# EAGLE design SVRBase (EAGLE 9.6.2)
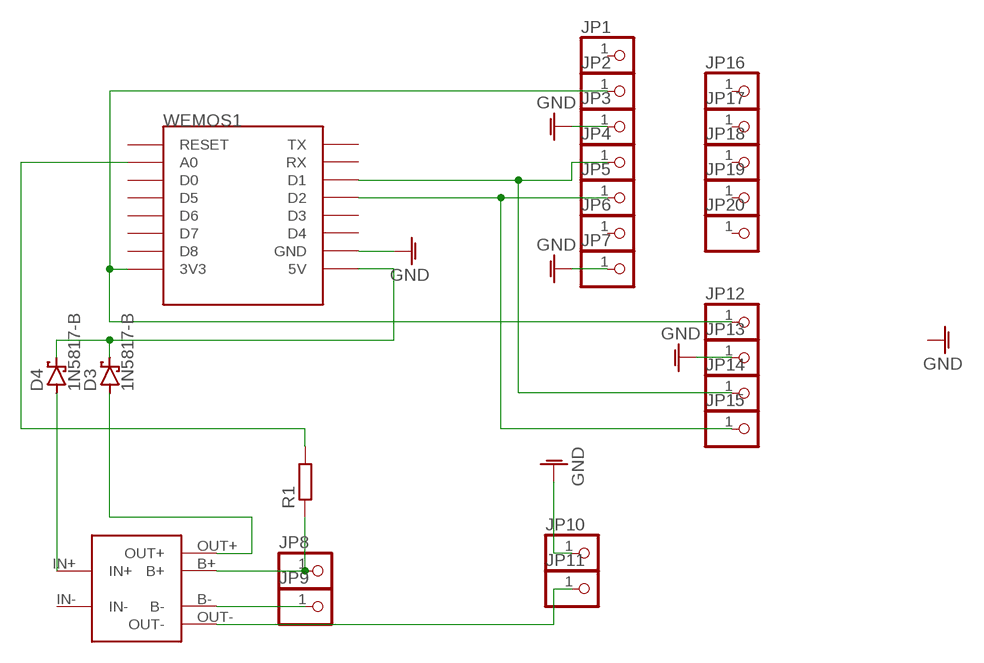
[diagram p0: schematic, sheet 1]

## Parts
CHARGING  TP4056-PTH  [TP4056-PTH]
D3  1N5817-B  [DO41-7.6]
D4  1N5817-B  [DO41-7.6]
JP1  PINHD-1X1  [1X01]
JP2  PINHD-1X1  [1X01]
JP3  PINHD-1X1  [1X01]
JP4  PINHD-1X1  [1X01]
JP5  PINHD-1X1  [1X01]
JP6  PINHD-1X1  [1X01]
JP7  PINHD-1X1  [1X01]
JP8  PINHD-1X1  [1X01]
JP9  PINHD-1X1  [1X01]
JP10  PINHD-1X1  [1X01]
JP11  PINHD-1X1  [1X01]
JP12  PINHD-1X1  [1X01]
JP13  PINHD-1X1  [1X01]
JP14  PINHD-1X1  [1X01]
JP15  PINHD-1X1  [1X01]
JP16  PINHD-1X1  [1X01]
JP17  PINHD-1X1  [1X01]
JP18  PINHD-1X1  [1X01]
JP19  PINHD-1X1  [1X01]
JP20  PINHD-1X1  [1X01]
R1  R-EU_0204/7  [0204/7]
WEMOS1  WEMOS-D1-MINI  [WEMOS-D1-MINI]

## Nets
GNDA: JP3.1 JP7.1 JP10.1 JP13.1 WEMOS1.GND ; supply symbol labelled GND
N$1: JP4.1 JP14.1 WEMOS1.D1
N$2: JP2.1 JP12.1 WEMOS1.3V3
N$3: CHARGING.B+ JP8.1 R1.1
N$4: D3.C D4.C WEMOS1.5V
N$5: CHARGING.IN+ D4.A
N$6: CHARGING.OUT+ D3.A
N$7: CHARGING.B- JP9.1
N$8: R1.2 WEMOS1.A0
N$9: CHARGING.OUT- JP11.1
N$10: JP5.1 JP15.1 WEMOS1.D2
Unconnected: CHARGING.IN- JP1.1 JP6.1 JP16.1 JP17.1 JP18.1 JP19.1 JP20.1 WEMOS1.D0 WEMOS1.D3 WEMOS1.D4 WEMOS1.D5 WEMOS1.D6 WEMOS1.D7 WEMOS1.D8 WEMOS1.RESET WEMOS1.RX WEMOS1.TX

## Library data of the parts
CHARGING = 32teeth - TP4056 Module:TP4056-PTH
D3 D4 = diode:1N581*: 1.0A SCHOTTKY BARRIER RECTIFIER Source: http://www.diodes.com/datasheets/ds23001.pdf
JP1-JP20 = pinhead:PINHD-1X1: PIN HEADER
R1 = rcl:R-EU_: RESISTOR, European symbol; SPICEPREFIX: R
WEMOS1 = Eagle Mixed Library:WEMOS-D1-MINI: WeMos.cc D1 mini ESP8266 module

## Board
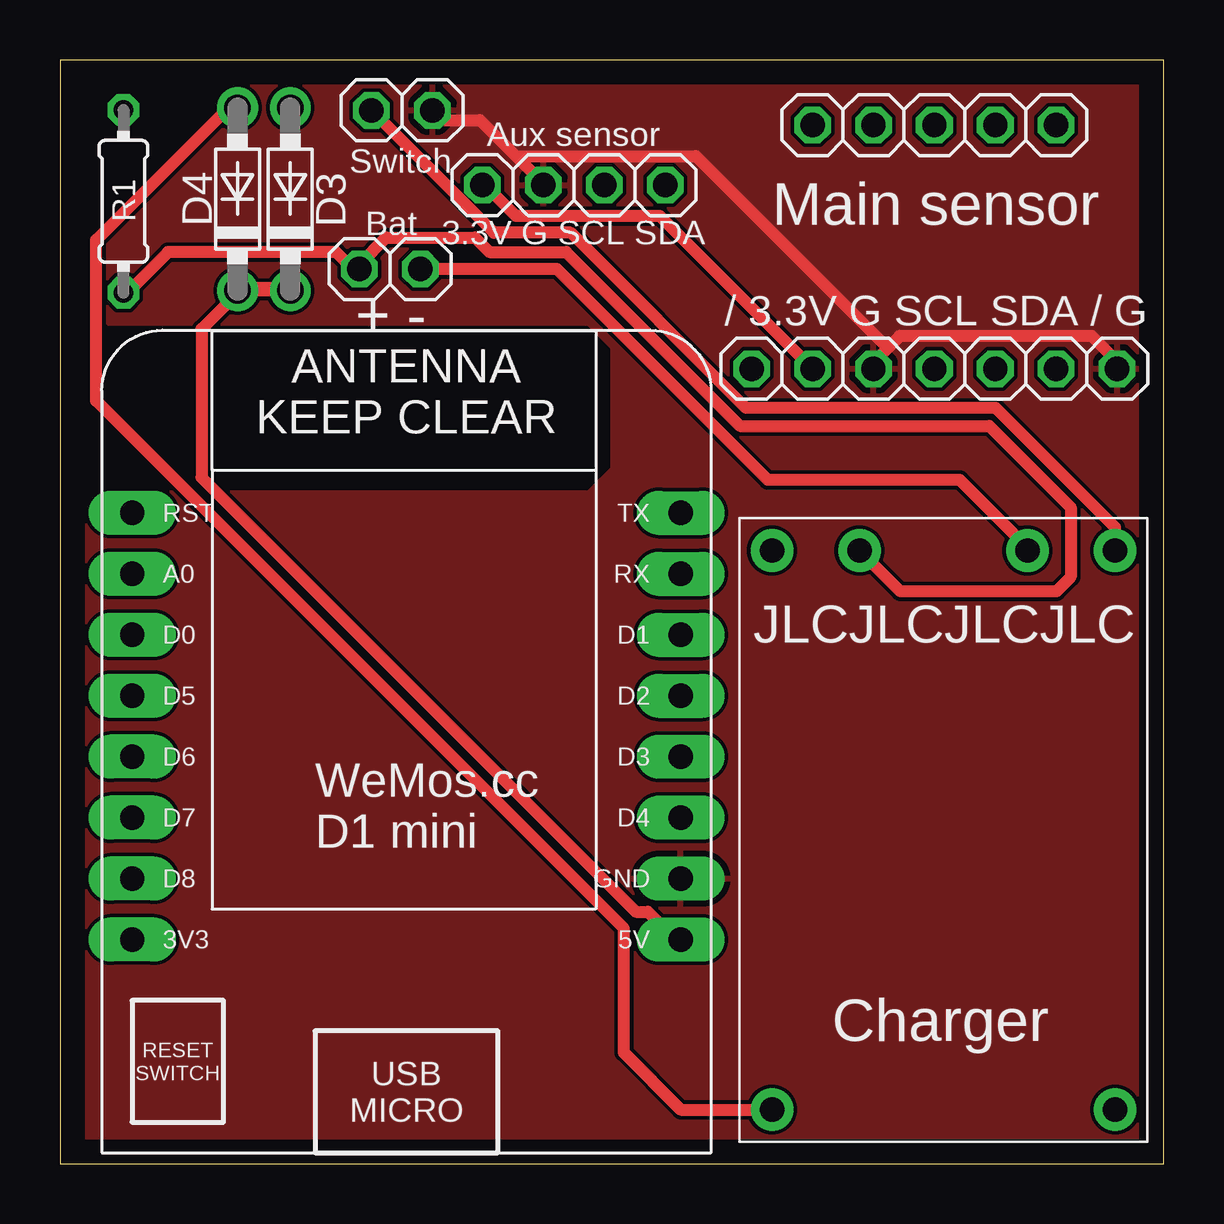
[diagram p1: board, top side]
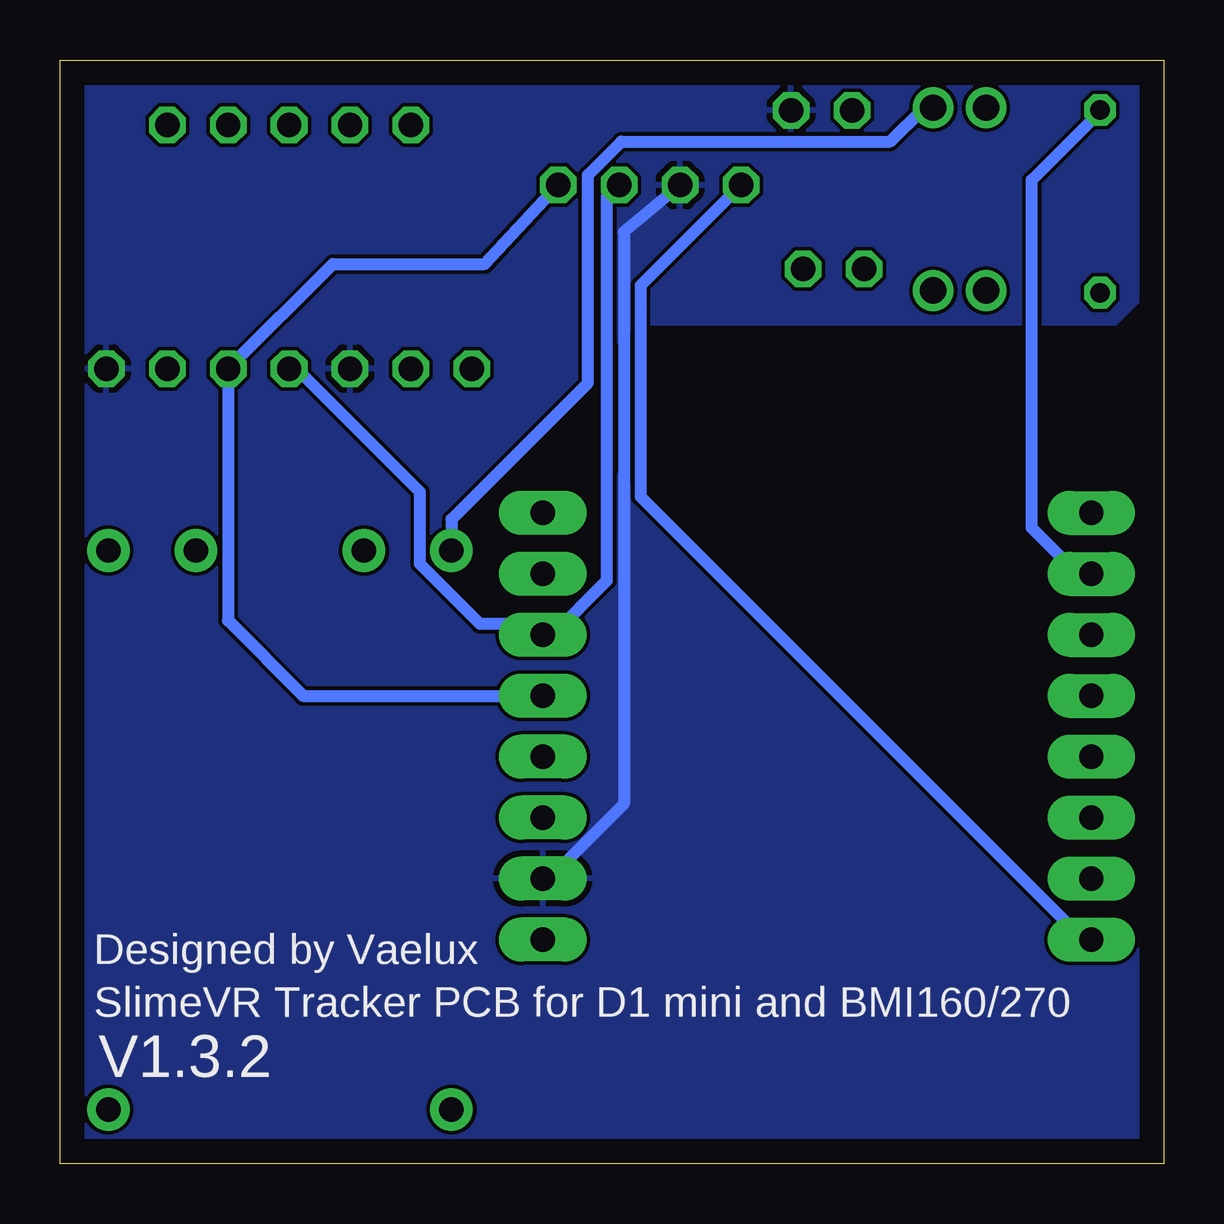
[diagram p2: board, bottom side, seen from below]

Size 46 x 46 mm. Coordinates in mm from the lower left corner, seen from the top.
Outline: 0,0 46,0 46,46 0,46 0,0
Copper layers (1*16): Top 0.035mm / dielectric 1.5mm / Bottom 0.035mm
Design rules "default *": minimum track width 20mil, minimum drill 0.35mm, track to track 6mil, track to pad 6mil, pad to pad 6mil, via to via 6mil, smd to smd 6mil, copper to edge 40mil, drill to drill 6mil, minimum pad ring 10mil, minimum via ring 8mil, stop-mask expansion 4mil, vias tented up to drill 0mil, thermal gap 10mil

### Footprints (pad centres in the part's own frame; a part is rotated, then mirrored left to right if it is on the bottom)
TP4056-PTH = drill 1.016 pad 1.778: B+ 12,1.35; B- 5,1.35; IN+ 15.65,24.65; IN- 1.35,24.65; OUT+ 15.65,1.35; OUT- 1.35,1.35
DO41-7.6 = drill 1.1 pad 1.7: A 3.81,0; C -3.81,0
1X01 = drill 1.016 octagon: 1 0,0
0204/7 = drill 0.813 octagon: 1 -3.81,0; 2 3.81,0
WEMOS-D1-MINI = drill 1.016 pad 1.829 long: 3V3 -10.16,-10.16; 5V 12.7,-10.16; A0 -10.16,5.08; D0 -10.16,2.54; D1 12.7,2.54; D2 12.7,0; D3 12.7,-2.54; D4 12.7,-5.08; D5 -10.16,0; D6 -10.16,-2.54; D7 -10.16,-5.08; D8 -10.16,-7.62; GND 12.7,-7.62; RESET -10.16,7.62; RX 12.7,5.08; TX 12.7,7.62

### Placement (x,y rotation side)
CHARGING  45.33,26.9 180 top
D3  9.6,40.2 90 top
D4  7.4,40.2 90 top
JP1  28.83,33.13 0 top
JP2  31.37,33.13 0 top
JP3  33.91,33.13 0 top
JP4  36.45,33.13 0 top
JP5  38.99,33.13 0 top
JP6  41.53,33.13 0 top
JP7  44.07,33.13 0 top
JP8  12.49,37.29 180 top
JP9  15.03,37.29 180 top
JP10  15.53,43.9 180 top
JP11  12.99,43.9 180 top
JP12  17.61,40.79 0 top
JP13  20.15,40.79 0 top
JP14  22.69,40.79 0 top
JP15  25.23,40.79 0 top
JP16  41.53,43.29 180 top
JP17  38.99,43.29 180 top
JP18  36.45,43.29 180 top
JP19  33.91,43.29 180 top
JP20  31.37,43.29 180 top
R1  2.65,40.11 90 top
WEMOS1  13.17,19.5 0 top

### Tracks (layer width: path | path; a pad name or v marks a point on that pad's centre or on a via)
GNDA
  Top 0.508: 34.5,34 35,34.5 43,34.5 44,33.5 JP7.1 | 34.5,34 34,33.5 JP3.1 | 19,42 17.5,43.5 16,43.5 JP10.1 | 19,42 20,41 JP13.1 | 34.5,34 26.5,42 19,42
  Bottom 0.508: WEMOS1.GND 25.5,12 22.5,15 22.5,38.84 JP13.1
  pour Top: 0,46 46,46 46,0 0,0 0,26 2,28 22,28 23,29 23,34 22,35 2,35 0,37
  pour Bottom: 0,46 46,46 46,0 0,0 0,26 2,28 22,28 23,29 23,34 22,35 2,35 0,37
N$1
  Bottom 0.508: JP14.1 23.2,40.31 23.2,24.3 25.5,22 WEMOS1.D1 26,22.5 28.5,22.5 31,25 31,28 36,33 JP4.1
N$2
  Top 0.508: JP12.1 18,40.5 19,39.5 25,39.5 31,33.5 JP2.1
  Bottom 0.508: JP12.1 21.8,36.6 21.8,27.8 3.5,9.5 WEMOS1.3V3
N$3
  Top 0.508: R1.1 3,36.5 4.5,38 11.5,38 12,37.5 JP8.1 12.5,37.5 13.6,38.6 17.3,38.6 17.9,38 21.1,38 28.35,30.75 38.73,30.75 42.13,27.35 42.13,24.45 41.53,23.85 35.03,23.85 CHARGING.B+
N$4
  Top 0.508: D4.C 7.5,36.5 9.5,36.5 D3.C 7.5,36.39 5.9,34.79 5.9,28.6 24,10.5 24.5,10.5 25.5,9.5 WEMOS1.5V
N$5
  Top 0.508: D4.A 7,44 1.5,38.5 1.5,31.8 23.5,9.8 23.5,4.63 25.88,2.25 CHARGING.IN+
N$6
  Bottom 0.508: D3.A 10,44 11.4,42.6 22.6,42.6 24,41.2 24,32.53 29.68,26.85 CHARGING.OUT+
N$7
  Top 0.508: JP9.1 20.71,37.29 29.5,28.5 37.5,28.5 40,26 CHARGING.B-
N$8
  Bottom 0.508: R1.2 3,43.5 5.5,41 5.5,26.5 3.5,24.5 WEMOS1.A0
N$9
  Top 0.508: JP11.1 18.09,38.8 21.3,38.8 28.6,31.5 39,31.5 43.98,26.52 CHARGING.OUT-
N$10
  Bottom 0.508: JP15.1 28.29,37.5 34.62,37.5 JP5.1 38.99,32.75 39,32.74 39,22.63 35.87,19.5 WEMOS1.D2

### Text on the board
tPlace: Switch | Aux sensor | Main sensor | Bat | 3.3V G SCL SDA | + - | / 3.3V G SCL SDA / G | JLCJLCJLCJLC | Charger
bPlace: Designed by Vaelux | SlimeVR Tracker PCB for D1 mini and BMI160/270 | V1.3.2